# EasyEDA schematic SCH_Pathfinder-V1_2025-12-04.json
TITLE: Sheet_1; REV: 1.0; Date: 2025-10-22; Sheet: 1/1; Drawn By: ryantaw; Company: Your Company
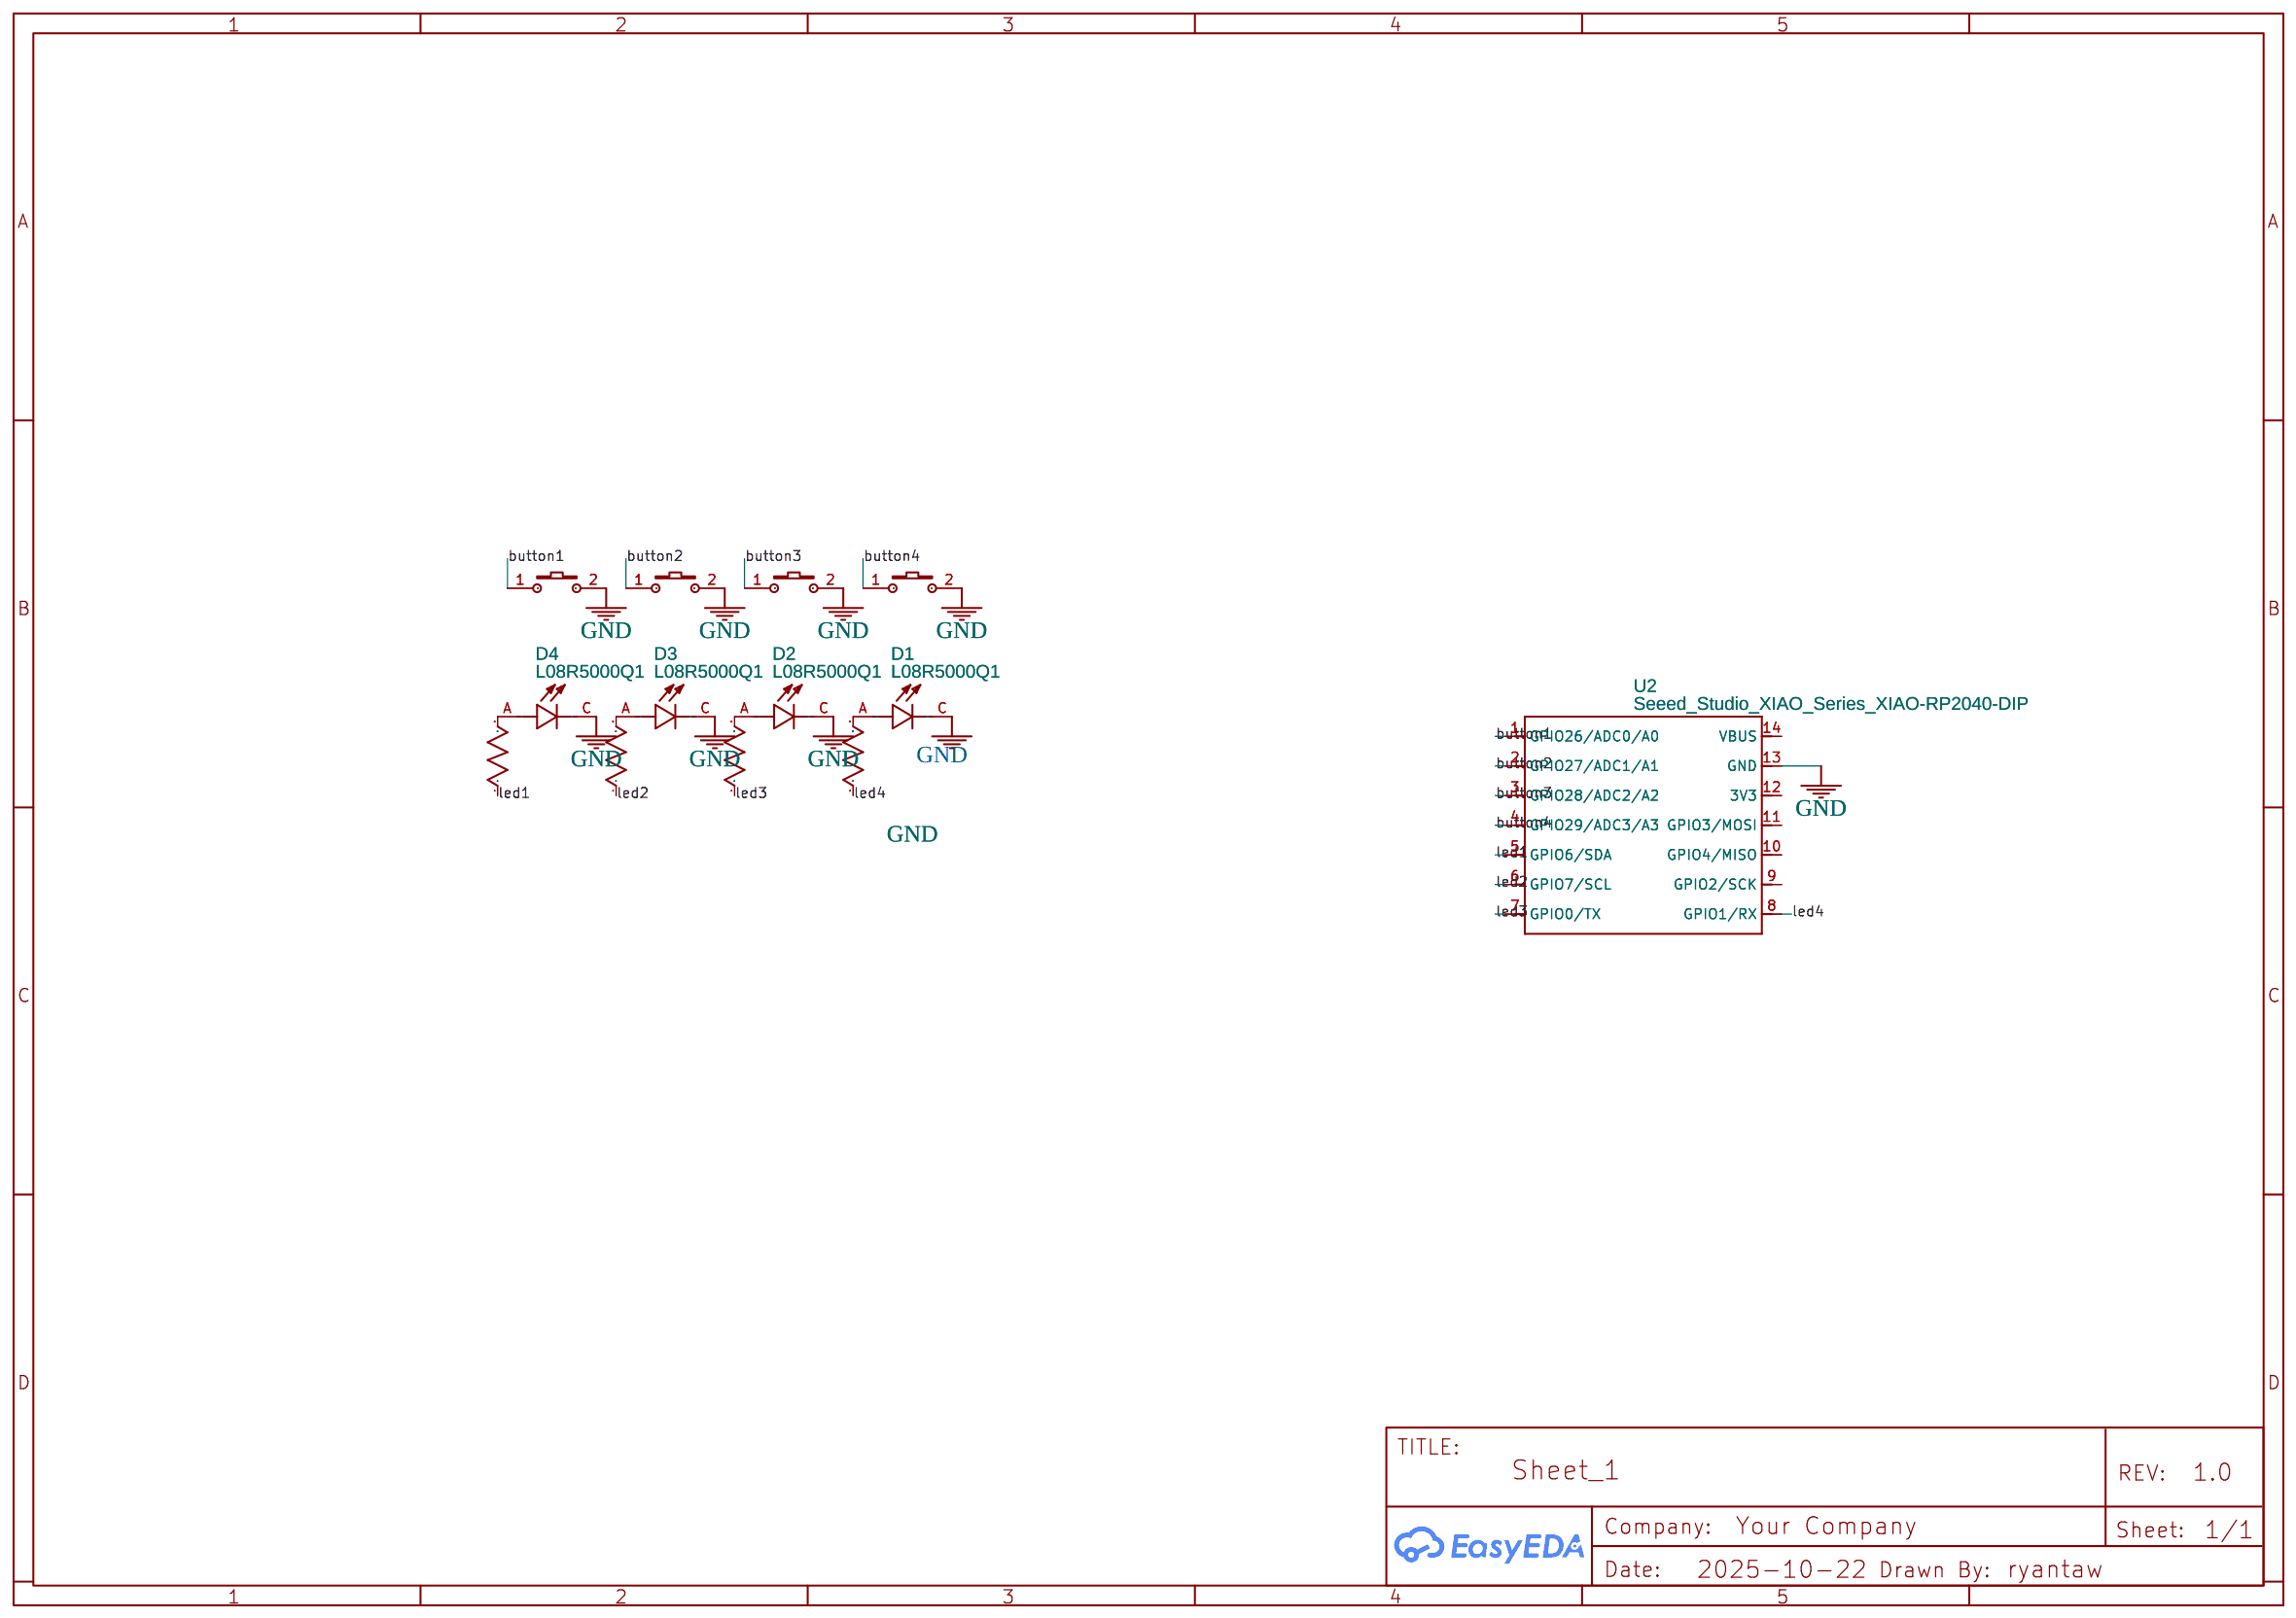
[diagram p0: schematic sheet]

## Parts
D1  L08R5000Q1  [LEDRD254W57D500H1070]
D2  L08R5000Q1  [LEDRD254W57D500H1070]
D3  L08R5000Q1  [LEDRD254W57D500H1070]
D4  L08R5000Q1  [LEDRD254W57D500H1070]
KEY1  K2-3.6×6.1_SMD  [CHERRY MX 1U]
KEY2  K2-3.6×6.1_SMD  [CHERRY MX 1U]
KEY3  K2-3.6×6.1_SMD  [CHERRY MX 1U]
KEY4  K2-3.6×6.1_SMD  [CHERRY MX 1U]
R1  1k  [R_AXIAL_DIN0204_L3.6MM_D1.6MM_P5.08MM_HORIZONTAL]
R2  1k  [R_AXIAL_DIN0204_L3.6MM_D1.6MM_P5.08MM_HORIZONTAL]
R3  1k  [R_AXIAL_DIN0204_L3.6MM_D1.6MM_P5.08MM_HORIZONTAL]
R4  1k  [R_AXIAL_DIN0204_L3.6MM_D1.6MM_P5.08MM_HORIZONTAL]
U2  Seeed_Studio_XIAO_Series_XIAO-RP2040-DIP  [VARISTOR:XIAO-RP2040-DIP]

## Library data of the parts
D1-D4 = L08R5000Q1: Contributor: aleca
KEY1-KEY4 = K2-3.6×6.1_SMD: Supplier Part: C118141; Supplier: LCSC; Manufacturer Part: K2-1107ST-A4SW-06; Contributor: LCEDA_Lib; 制造商: 韩国韩荣
R1-R4 = R_0603_US: Contributor: LCEDA_Lib
U2 = Seeed_Studio_XIAO_Series_XIAO-RP2040-DIP: Add into BOM: yes; Convert to PCB: yes; Contributor: ryantaw

## Nets
GND: D1.C D2.C D3.C D4.C KEY1.2 KEY2.2 KEY3.2 KEY4.2 U2.13(GND)
button1: KEY1.1 U2.1(GPIO26/ADC0/A0)
button2: KEY2.1 U2.2(GPIO27/ADC1/A1)
button3: KEY3.1 U2.3(GPIO28/ADC2/A2)
button4: KEY4.1 U2.4(GPIO29/ADC3/A3)
led1: R1.1 U2.5(GPIO6/SDA)
led2: R2.1 U2.6(GPIO7/SCL)
led3: R3.1 U2.7(GPIO0/TX)
led4: R4.1 U2.8(GPIO1/RX)
Net-(D1-A): D1.A R4.2
Net-(D2-A): D2.A R3.2
Net-(D3-A): D3.A R2.2
Net-(D4-A): D4.A R1.2

Not connected (* = marked no-connect by the designer): U2 9(GPIO2/SCK) 10(GPIO4/MISO) 11(GPIO3/MOSI) 12(3V3) 14(VBUS)

## Notes on the sheet
- GND
